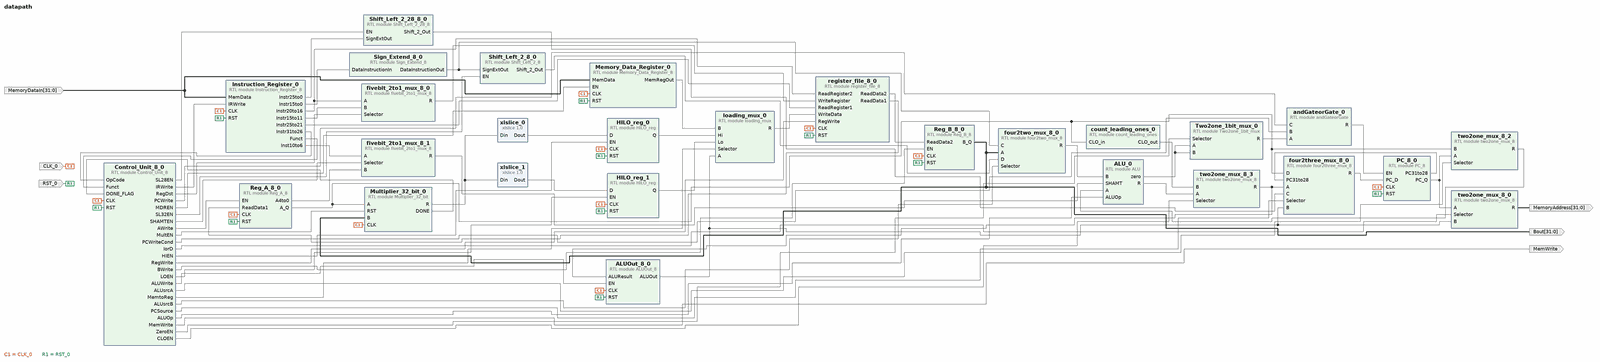
[diagram p0: block diagram of the top level, whole]
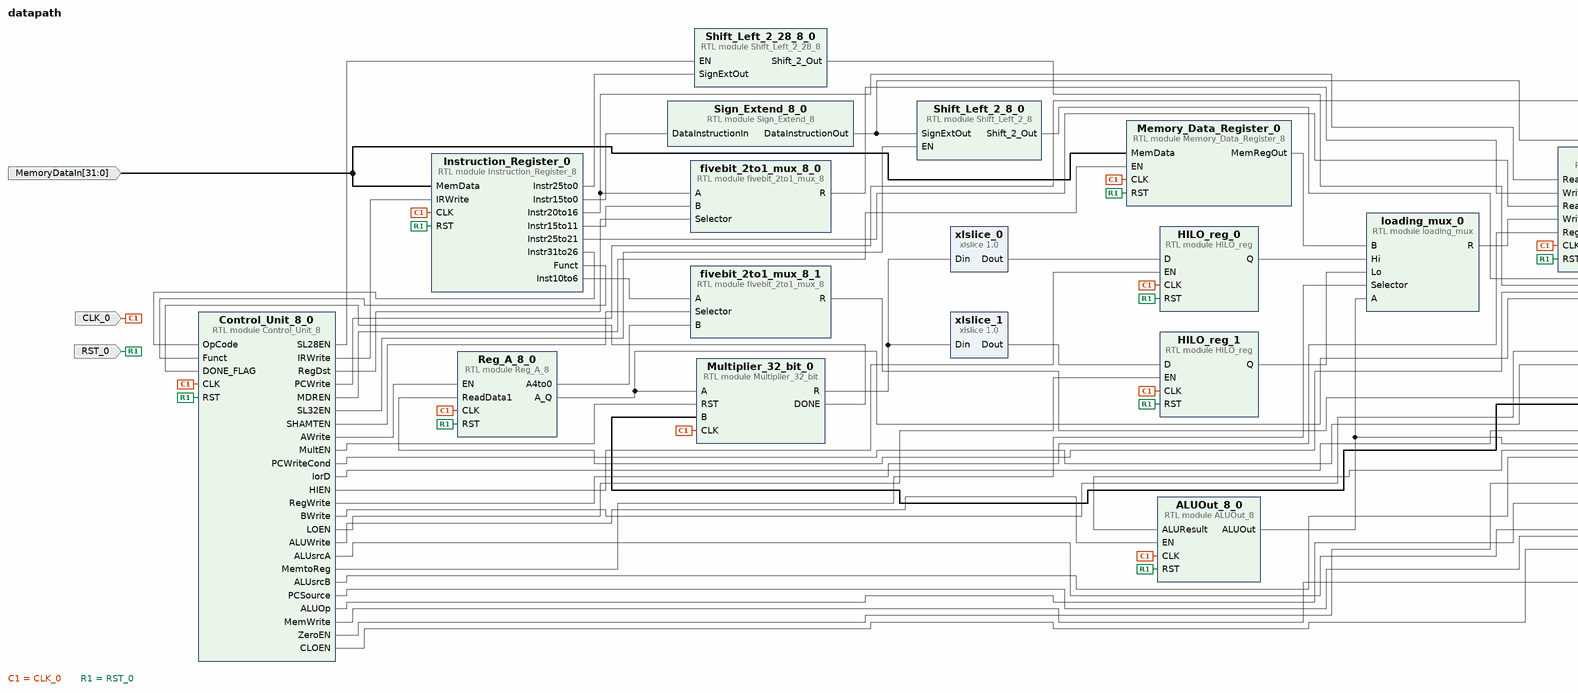
[diagram p1: block diagram of the top level, left part]
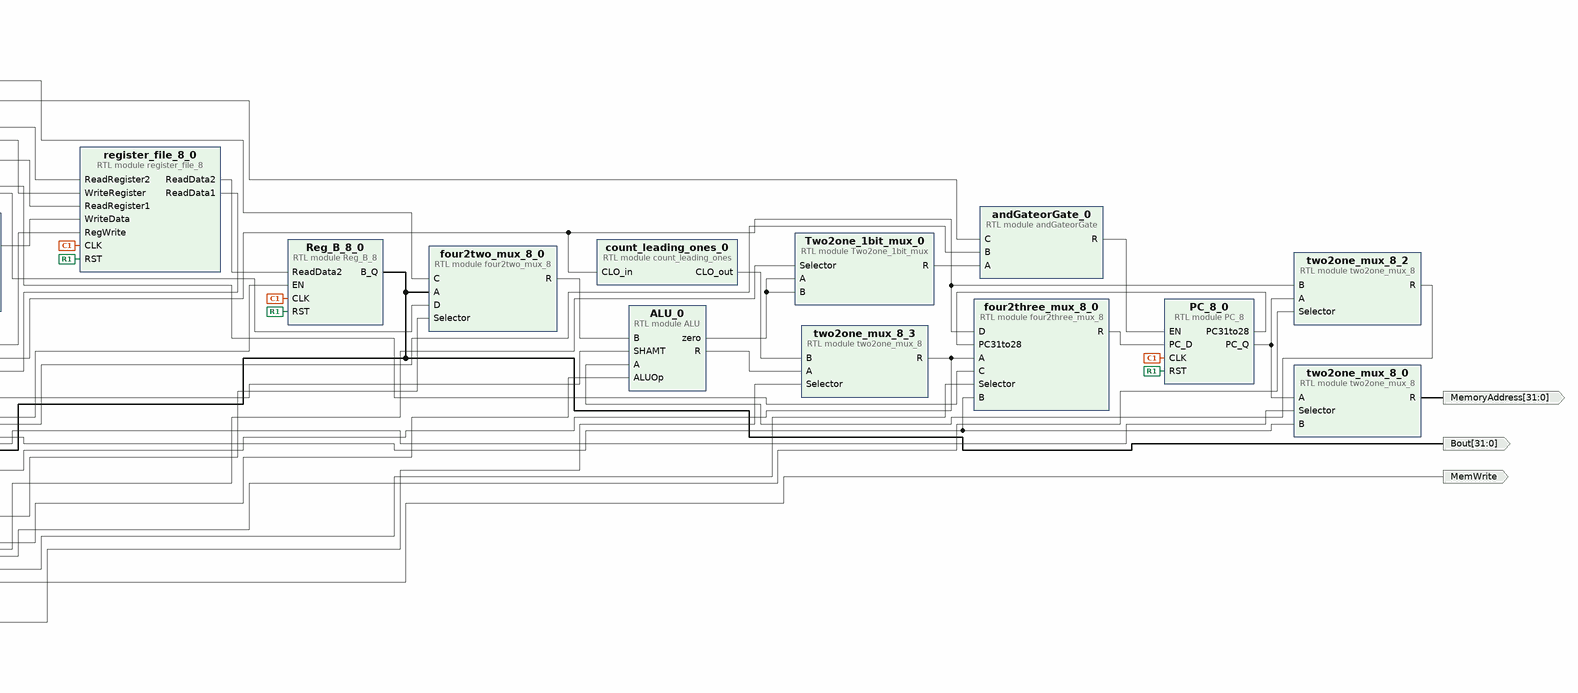
[diagram p2: block diagram of the top level, right part]
# Vivado block design datapath, xc7z020clg400-1, Vivado 2018.3
create_bd_design datapath

create_bd_port -dir I -type clk CLK_0
create_bd_port -dir I -type rst RST_0
create_bd_port -dir O MemWrite
create_bd_port -dir O -from 31 -to 0 MemoryAddress
create_bd_port -dir O -from 31 -to 0 Bout
create_bd_port -dir I -from 31 -to 0 MemoryDataIn

create_bd_cell -type module -reference Shift_Left_2_8 Shift_Left_2_8_0
create_bd_cell -type module -reference Shift_Left_2_28_8 Shift_Left_2_28_8_0
create_bd_cell -type module -reference andGateorGate andGateorGate_0
create_bd_cell -type module -reference Sign_Extend_8 Sign_Extend_8_0
create_bd_cell -type module -reference two2one_mux_8 two2one_mux_8_2
create_bd_cell -type module -reference four2two_mux_8 four2two_mux_8_0
create_bd_cell -type module -reference four2three_mux_8 four2three_mux_8_0
create_bd_cell -type module -reference fivebit_2to1_mux_8 fivebit_2to1_mux_8_0
create_bd_cell -type module -reference Reg_B_8 Reg_B_8_0
create_bd_cell -type module -reference PC_8 PC_8_0
create_bd_cell -type module -reference ALUOut_8 ALUOut_8_0
create_bd_cell -type module -reference Reg_A_8 Reg_A_8_0
create_bd_cell -type module -reference Instruction_Register_8 Instruction_Register_0
create_bd_cell -type module -reference fivebit_2to1_mux_8 fivebit_2to1_mux_8_1
create_bd_cell -type module -reference Two2one_1bit_mux Two2one_1bit_mux_0
create_bd_cell -type module -reference count_leading_ones count_leading_ones_0
create_bd_cell -type module -reference two2one_mux_8 two2one_mux_8_3
create_bd_cell -type module -reference Memory_Data_Register_8 Memory_Data_Register_0
create_bd_cell -type module -reference two2one_mux_8 two2one_mux_8_0
create_bd_cell -type module -reference register_file_8 register_file_8_0
create_bd_cell -type ip -vlnv xilinx.com:ip:xlslice:1.0 xlslice_0
set_property -dict {CONFIG.DIN_FROM 63 CONFIG.DIN_TO 32 CONFIG.DIN_WIDTH 64 CONFIG.DOUT_WIDTH 1} [get_bd_cells xlslice_0]
create_bd_cell -type ip -vlnv xilinx.com:ip:xlslice:1.0 xlslice_1
set_property -dict {CONFIG.DIN_FROM 31 CONFIG.DIN_TO 0 CONFIG.DIN_WIDTH 64 CONFIG.DOUT_WIDTH 32} [get_bd_cells xlslice_1]
create_bd_cell -type module -reference loading_mux loading_mux_0
create_bd_cell -type module -reference HILO_reg HILO_reg_0
create_bd_cell -type module -reference HILO_reg HILO_reg_1
create_bd_cell -type module -reference ALU ALU_0
create_bd_cell -type module -reference Multiplier_32_bit Multiplier_32_bit_0
create_bd_cell -type module -reference Control_Unit_8 Control_Unit_8_0

# ---- connections ----

connect_bd_net [get_bd_pins Control_Unit_8_0/PCWrite] [get_bd_pins andGateorGate_0/C]
connect_bd_net [get_bd_pins Control_Unit_8_0/PCWriteCond] [get_bd_pins andGateorGate_0/B]
connect_bd_net [get_bd_pins andGateorGate_0/R] [get_bd_pins PC_8_0/EN]
connect_bd_net [get_bd_pins four2three_mux_8_0/R] [get_bd_pins PC_8_0/PC_D]
connect_bd_net [get_bd_pins Control_Unit_8_0/IorD] [get_bd_pins two2one_mux_8_0/Selector]
connect_bd_net [get_bd_pins PC_8_0/PC_Q] [get_bd_pins two2one_mux_8_2/A] [get_bd_pins two2one_mux_8_0/A]
connect_bd_net [get_bd_pins Control_Unit_8_0/IRWrite] [get_bd_pins Instruction_Register_0/IRWrite]
connect_bd_net [get_bd_pins Control_Unit_8_0/MDREN] [get_bd_pins Memory_Data_Register_0/EN]
connect_bd_net [get_bd_pins fivebit_2to1_mux_8_0/R] [get_bd_pins register_file_8_0/WriteRegister]
connect_bd_net [get_bd_pins Instruction_Register_0/Instr20to16] [get_bd_pins fivebit_2to1_mux_8_0/A] [get_bd_pins register_file_8_0/ReadRegister2]
connect_bd_net [get_bd_pins Instruction_Register_0/Instr15to11] [get_bd_pins fivebit_2to1_mux_8_0/B]
connect_bd_net [get_bd_pins Control_Unit_8_0/RegDst] [get_bd_pins fivebit_2to1_mux_8_0/Selector]
connect_bd_net [get_bd_pins Instruction_Register_0/Instr31to26] [get_bd_pins Control_Unit_8_0/OpCode]
connect_bd_net [get_bd_pins Control_Unit_8_0/RegWrite] [get_bd_pins register_file_8_0/RegWrite]
connect_bd_net [get_bd_pins Instruction_Register_0/Instr25to21] [get_bd_pins register_file_8_0/ReadRegister1]
connect_bd_net [get_bd_pins Instruction_Register_0/Instr15to0] [get_bd_pins Sign_Extend_8_0/DataInstructionIn]
connect_bd_net [get_bd_pins Sign_Extend_8_0/DataInstructionOut] [get_bd_pins Shift_Left_2_8_0/SignExtOut] [get_bd_pins four2two_mux_8_0/C]
connect_bd_net [get_bd_pins register_file_8_0/ReadData1] [get_bd_pins Reg_A_8_0/ReadData1]
connect_bd_net [get_bd_pins register_file_8_0/ReadData2] [get_bd_pins Reg_B_8_0/ReadData2]
connect_bd_net [get_bd_pins Control_Unit_8_0/AWrite] [get_bd_pins Reg_A_8_0/EN]
connect_bd_net [get_bd_pins Control_Unit_8_0/BWrite] [get_bd_pins Reg_B_8_0/EN]
connect_bd_net [get_bd_pins Reg_A_8_0/A_Q] \
  [get_bd_pins two2one_mux_8_2/B] [get_bd_pins count_leading_ones_0/CLO_in] [get_bd_pins four2three_mux_8_0/D] \
  [get_bd_pins Multiplier_32_bit_0/A]
connect_bd_net [get_bd_pins Control_Unit_8_0/ALUsrcA] [get_bd_pins two2one_mux_8_2/Selector]
connect_bd_net [get_bd_pins Reg_B_8_0/B_Q] [get_bd_pins four2two_mux_8_0/A] [get_bd_ports Bout] [get_bd_pins Multiplier_32_bit_0/B]
connect_bd_net [get_bd_pins Shift_Left_2_8_0/Shift_2_Out] [get_bd_pins four2two_mux_8_0/D]
connect_bd_net [get_bd_pins Control_Unit_8_0/ALUsrcB] [get_bd_pins four2two_mux_8_0/Selector]
connect_bd_net [get_bd_pins two2one_mux_8_2/R] [get_bd_pins ALU_0/A]
connect_bd_net [get_bd_pins four2two_mux_8_0/R] [get_bd_pins ALU_0/B]
connect_bd_net -net ALU_0_R [get_bd_pins two2one_mux_8_3/R] [get_bd_pins four2three_mux_8_0/A] [get_bd_pins ALUOut_8_0/ALUResult]
connect_bd_net [get_bd_pins Instruction_Register_0/Instr25to0] [get_bd_pins Shift_Left_2_28_8_0/SignExtOut]
connect_bd_net [get_bd_pins Control_Unit_8_0/SL28EN] [get_bd_pins Shift_Left_2_28_8_0/EN]
connect_bd_net [get_bd_pins Control_Unit_8_0/SL32EN] [get_bd_pins Shift_Left_2_8_0/EN]
connect_bd_net [get_bd_pins Control_Unit_8_0/ALUWrite] [get_bd_pins ALUOut_8_0/EN]
connect_bd_net [get_bd_pins Shift_Left_2_28_8_0/Shift_2_Out] [get_bd_pins four2three_mux_8_0/C]
connect_bd_net [get_bd_pins PC_8_0/PC31to28] [get_bd_pins four2three_mux_8_0/PC31to28]
connect_bd_net [get_bd_pins Control_Unit_8_0/PCSource] [get_bd_pins four2three_mux_8_0/Selector]
connect_bd_net [get_bd_pins Control_Unit_8_0/ALUOp] [get_bd_pins ALU_0/ALUOp]
connect_bd_net [get_bd_pins Instruction_Register_0/Funct] [get_bd_pins Control_Unit_8_0/Funct]
connect_bd_net [get_bd_pins two2one_mux_8_0/R] [get_bd_ports MemoryAddress]
connect_bd_net [get_bd_pins Control_Unit_8_0/MemWrite] [get_bd_ports MemWrite]
connect_bd_net -net CLK_0_1 [get_bd_ports CLK_0] \
  [get_bd_pins Reg_B_8_0/CLK] [get_bd_pins PC_8_0/CLK] [get_bd_pins ALUOut_8_0/CLK] [get_bd_pins Reg_A_8_0/CLK] \
  [get_bd_pins Instruction_Register_0/CLK] [get_bd_pins Memory_Data_Register_0/CLK] [get_bd_pins register_file_8_0/CLK] \
  [get_bd_pins HILO_reg_0/CLK] [get_bd_pins HILO_reg_1/CLK] [get_bd_pins Multiplier_32_bit_0/CLK] \
  [get_bd_pins Control_Unit_8_0/CLK]
connect_bd_net -net RST_0_1 [get_bd_ports RST_0] \
  [get_bd_pins Reg_B_8_0/RST] [get_bd_pins PC_8_0/RST] [get_bd_pins ALUOut_8_0/RST] [get_bd_pins Reg_A_8_0/RST] \
  [get_bd_pins Instruction_Register_0/RST] [get_bd_pins Memory_Data_Register_0/RST] [get_bd_pins register_file_8_0/RST] \
  [get_bd_pins HILO_reg_0/RST] [get_bd_pins HILO_reg_1/RST] [get_bd_pins Control_Unit_8_0/RST]
connect_bd_net [get_bd_pins Reg_A_8_0/A4to0] [get_bd_pins fivebit_2to1_mux_8_1/B]
connect_bd_net [get_bd_pins Instruction_Register_0/Inst10to6] [get_bd_pins fivebit_2to1_mux_8_1/A]
connect_bd_net [get_bd_pins Control_Unit_8_0/SHAMTEN] [get_bd_pins fivebit_2to1_mux_8_1/Selector]
connect_bd_net [get_bd_pins fivebit_2to1_mux_8_1/R] [get_bd_pins ALU_0/SHAMT]
connect_bd_net [get_bd_pins Control_Unit_8_0/ZeroEN] [get_bd_pins Two2one_1bit_mux_0/Selector]
connect_bd_net [get_bd_pins ALU_0/zero] [get_bd_pins Two2one_1bit_mux_0/B] [get_bd_pins Two2one_1bit_mux_0/A]
connect_bd_net [get_bd_pins Two2one_1bit_mux_0/R] [get_bd_pins andGateorGate_0/A]
connect_bd_net [get_bd_pins Control_Unit_8_0/CLOEN] [get_bd_pins two2one_mux_8_3/Selector]
connect_bd_net [get_bd_pins ALU_0/R] [get_bd_pins two2one_mux_8_3/A]
connect_bd_net [get_bd_pins count_leading_ones_0/CLO_out] [get_bd_pins two2one_mux_8_3/B]
connect_bd_net [get_bd_pins loading_mux_0/R] [get_bd_pins register_file_8_0/WriteData]
connect_bd_net [get_bd_pins Control_Unit_8_0/MemtoReg] [get_bd_pins loading_mux_0/Selector]
connect_bd_net [get_bd_pins Memory_Data_Register_0/MemRegOut] [get_bd_pins loading_mux_0/B]
connect_bd_net [get_bd_pins ALUOut_8_0/ALUOut] [get_bd_pins four2three_mux_8_0/B] [get_bd_pins two2one_mux_8_0/B] [get_bd_pins loading_mux_0/A]
connect_bd_net [get_bd_pins Multiplier_32_bit_0/R] [get_bd_pins xlslice_0/Din] [get_bd_pins xlslice_1/Din]
connect_bd_net [get_bd_pins Multiplier_32_bit_0/DONE] [get_bd_pins Control_Unit_8_0/DONE_FLAG]
connect_bd_net [get_bd_pins xlslice_0/Dout] [get_bd_pins HILO_reg_0/D]
connect_bd_net [get_bd_pins xlslice_1/Dout] [get_bd_pins HILO_reg_1/D]
connect_bd_net [get_bd_pins HILO_reg_0/Q] [get_bd_pins loading_mux_0/Hi]
connect_bd_net [get_bd_pins HILO_reg_1/Q] [get_bd_pins loading_mux_0/Lo]
connect_bd_net [get_bd_pins Control_Unit_8_0/HIEN] [get_bd_pins HILO_reg_0/EN]
connect_bd_net -net Control_Unit_8_0_LOIN [get_bd_pins Control_Unit_8_0/LOEN] [get_bd_pins HILO_reg_1/EN]
connect_bd_net [get_bd_pins Control_Unit_8_0/MultEN] [get_bd_pins Multiplier_32_bit_0/RST]
connect_bd_net -net CPU_memory_0_dataOut [get_bd_ports MemoryDataIn] \
  [get_bd_pins Memory_Data_Register_0/MemData] [get_bd_pins Instruction_Register_0/MemData]

validate_bd_design
save_bd_design
